# EAGLE design robotario-2 (EAGLE 9.5.1)
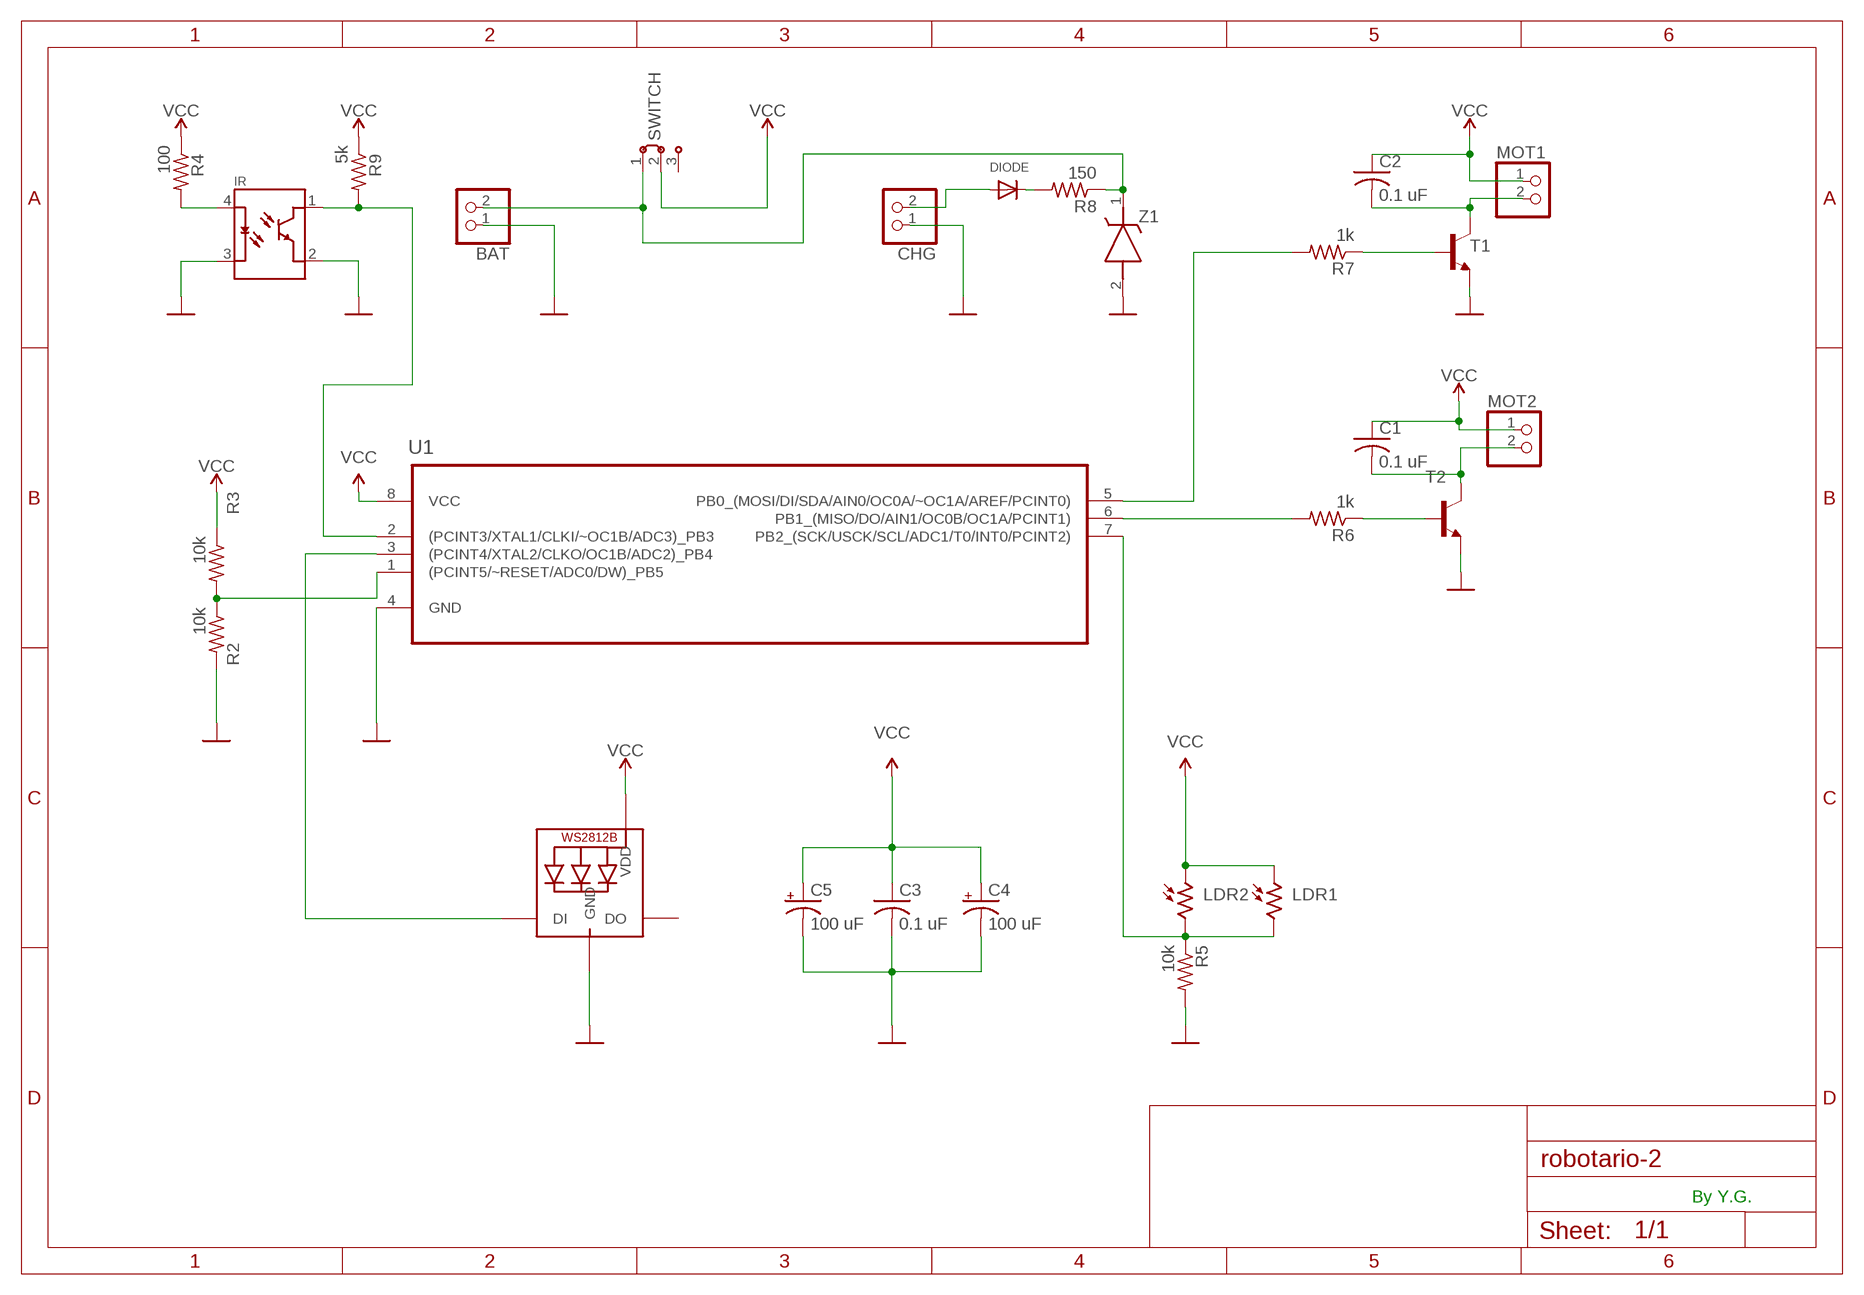
[diagram p0: schematic, sheet 1]
FRAME1 (A4L-LOC): AUTHOR: Y.

## Parts
BAT  PINHD-1X2  [1X02]
C1  0.1 uF  C-US050-024X044  [C050-024X044]
C2  0.1 uF  C-US050-024X044  [C050-024X044]
C3  0.1 uF  C-US050-024X044  [C050-024X044]
C4  100 uF  CPOL-USE5-5  [E5-5]
C5  100 uF  CPOL-USE5-5  [E5-5]
CHG  PINHD-1X2  [1X02]
DIODE  DIODEDO-1N4148  [DO-1N4148]
IR  TCRT5000L  [XDCR_TCRT5000L]
LDR1  A1050_14  [T0-46-A10XX]
LDR2  A1050_14  [T0-46-A10XX]
LED2  WS2812B5050  [WS2812B]
MOT1  PINHD-1X2  [1X02]
MOT2  PINHD-1X2  [1X02]
R2  10k  R-US_0207/10  [0207/10]
R3  10k  R-US_0207/10  [0207/10]
R4  100  R-US_0207/10  [0207/10]
R5  10k  R-US_0207/10  [0207/10]
R6  1k  R-US_0207/10  [0207/10]
R7  1k  R-US_0207/10  [0207/10]
R8  150  R-US_0207/10  [0207/10]
R9  5k  R-US_0207/10  [0207/10]
SWITCH  J2X2MM  [04C]
T1  2N3904  [TO92]
T2  2N3904  [TO92]
U1  ATTINY85-20PU  [DIP254P762X533-8]
Z1  NZX4V3C  BZX55C10  [DIOAD950W60L350D150]

## Nets
GND: BAT.1 C3.2 C4.- C5.- CHG.1 IR.2(E) IR.3(C) LED2.3-GND(GND) R2.2 R5.2 T1.3(E) T2.3(E) U1.4(GND) Z1.2(A)
N$1: BAT.2 R8.1 SWITCH.1 Z1.1(K)
N$2: R6.1 T2.2(B)
N$3: R7.1 T1.2(B)
N$4: R2.1 R3.2 U1.1((PCINT5/~RESET/ADC0/DW)_PB5)
N$5: IR.1(CO) R9.2 U1.2((PCINT3/XTAL1/CLKI/~OC1B/ADC3)_PB3)
N$6: LDR1.2 LDR2.2 R5.1 U1.7(PB2_(SCK/USCK/SCL/ADC1/T0/INT0/PCINT2))
N$7: C2.2 MOT1.2 T1.1(C)
N$8: CHG.2 DIODE.A
N$9: LED2.4-DIN(DI) U1.3((PCINT4/XTAL2/CLKO/OC1B/ADC2)_PB4)
N$10: C1.2 MOT2.2 T2.1(C)
N$11: R7.2 U1.5(PB0_(MOSI/DI/SDA/AIN0/OC0A/~OC1A/AREF/PCINT0))
N$12: R6.2 U1.6(PB1_(MISO/DO/AIN1/OC0B/OC1A/PCINT1))
N$14: DIODE.C R8.2
N$15: IR.4(A) R4.2
VCC: C1.1 C2.1 C3.1 C4.+ C5.+ LDR1.1 LDR2.1 LED2.1-VDD(VDD) MOT1.1 MOT2.1 R3.1 R4.1 R9.1 SWITCH.2 U1.8(VCC)
Unconnected: LED2.2-DOUT(DO) SWITCH.3

## Notes on the sheet
- By Y.G.

## Library data of the parts
BAT CHG MOT1 MOT2 = pinhead:PINHD-1X2: PIN HEADER
C1-C3 = adafruit:C-US: CAPACITOR, American symbol
C4 C5 = adafruit:CPOL-US: POLARIZED CAPACITOR, American symbol
DIODE = adafruit:DIODE: Diode SMADIODE - SMA Surface Mount Package 20V 1A Schottky Diode Digikey: 641-1014-6-ND DO-1N4148 - Through Hole Small Current Diode SOD-123 20V 1 A (.5mV Vf) Schottky Diode - Digikey: MBRX120TPMSCT-ND SOD-323 10V 570mA (.38mV Vf, 3ns) Schottky Diode - Digikey: ZLLS410CT-ND SOD-523 30V 30mA Schottky Diode (RB751S-40TE61) - Digikey: RB751S-40TE61CT-ND SOT23-R/W - SOT23 Package (R = Solder Paste/Reflow Ovens, W = Hand-Soldering) BAT54Film 40V 300mA - Digikey: 497-7162-1-ND
IR = TCRT5000L-edit:TCRT5000L: TCRT5000 Series 940 nm 100 mA 60 mA Transistor Output Reflective Optical Sensor; AVAILABILITY: Unavailable; DESCRIPTION: Photointerrupter Reflective Phototransistor 4-Pin Tube; MF: Vishay; MP: TCRT5000L; PACKAGE: PCB Mount Vishay Semiconductor; PRICE: None
LDR1 LDR2 = photo-elements:A10: Sensor Robust Light Sensing Applications Outdoor Light Sensing Application Source: http://optoelectronics.perkinelmer.com/content/Datasheets/DTS_PhotocellsA1050.pdf
LED2 = WS2812B:WS2812B; AVAILABILITY: Unavailable; DESCRIPTION: Intelligent Control Led Integrated Light Source Pack Of 10; MF: SparkFun Electronics; MP: WS2812B; PACKAGE: None; PRICE: None
R2-R9 = adafruit:R-US_: RESISTOR, American symbol
SWITCH = new-switch:J2: Jumper switch 2 x 2.5 mm
T1 T2 = new-t:2N3904: NPN TRANSISTOR
U1 = ATTINY85-20PU:ATTINY85-20PU: 8-bit Microcontroller with In-System Programmable Flash; AVAILABILITY: Unavailable; DESCRIPTION: ATtiny Series 20 MHz 8 KB Flash 512 B SRAM 8-Bit Microcontroller - DIP-8; MF: Microchip; MP: ATTINY85-20PU; PACKAGE: DIP-8 Microchip; PRICE: None
Z1 = BZX55C10:BZX55C10: Zener diode, 10V, 500mW, DO-35 Source: Datasheet <http://www.vishay.com/docs/85604/bzx55-se.pdf>; DESCRIPTION: BZX55 Series 10 V ±5 % 500 mW Through Hole Small Signal Zener Diode - DO-35; DIGI-KEY_PART_NUMBER: BZX55C10-GICT-ND; DIGI-KEY_PURCHASE_URL: https://www.digikey.hk/product-detail/en/vishay-semiconductor-diodes-division/BZX55C10-TR/BZX55C10-GICT-ND/6228440?utm_source=snapeda&utm_medium=aggregator&utm_campaign=symbol; MF: Vishay Semiconductor; MP: BZX55C10-TR; PACKAGE: DO-35 Vishay Semiconductor

## Board
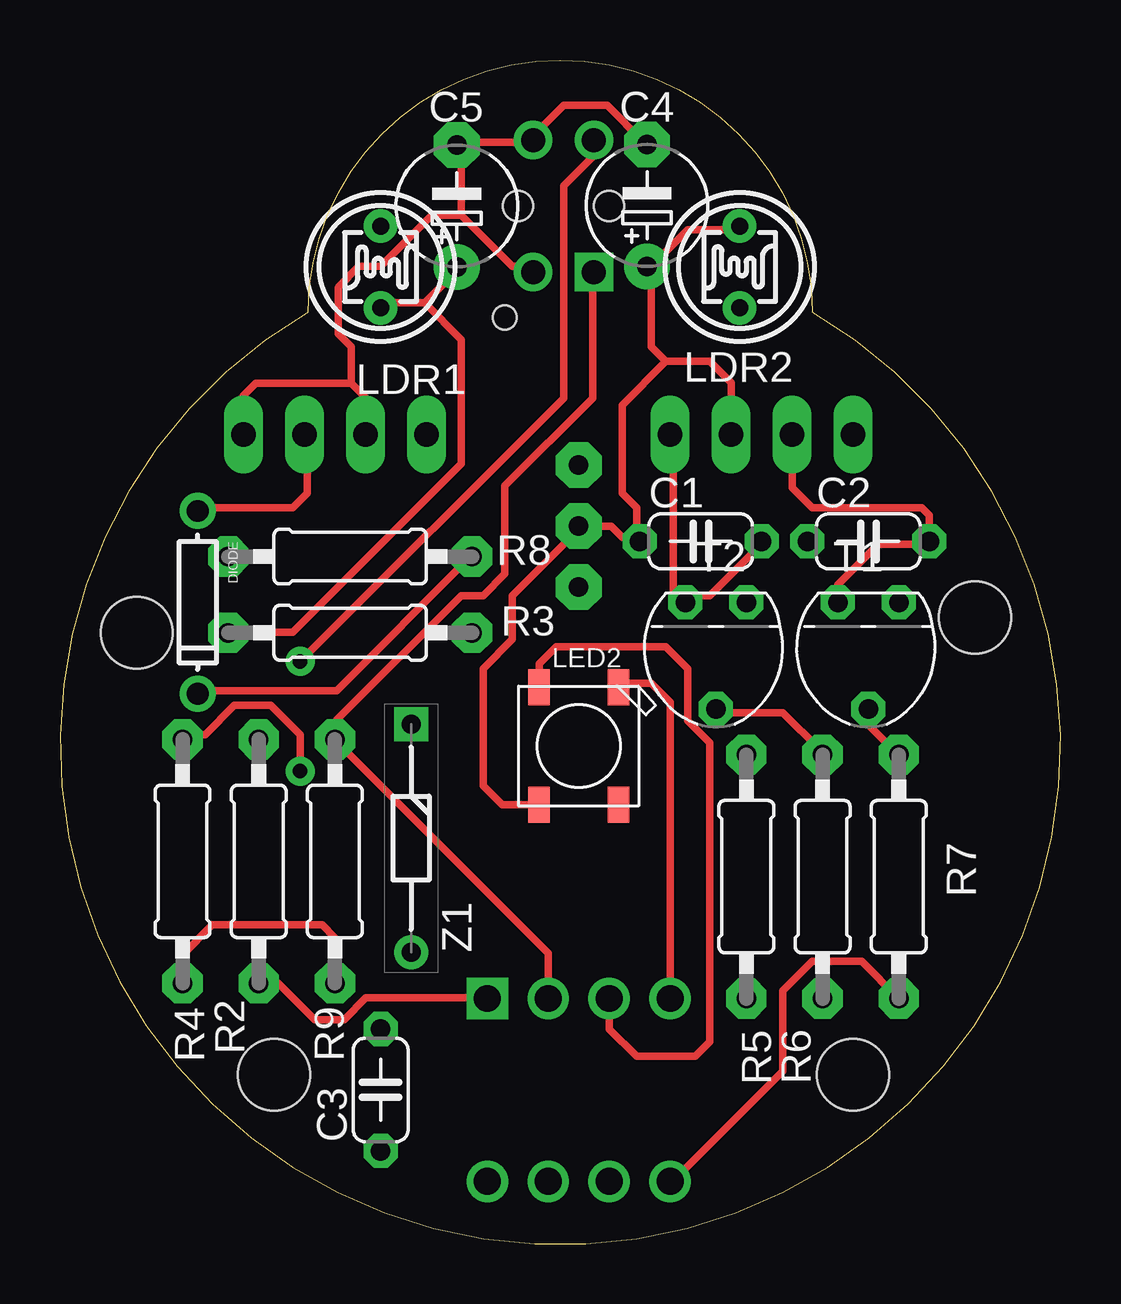
[diagram p1: board, top side]
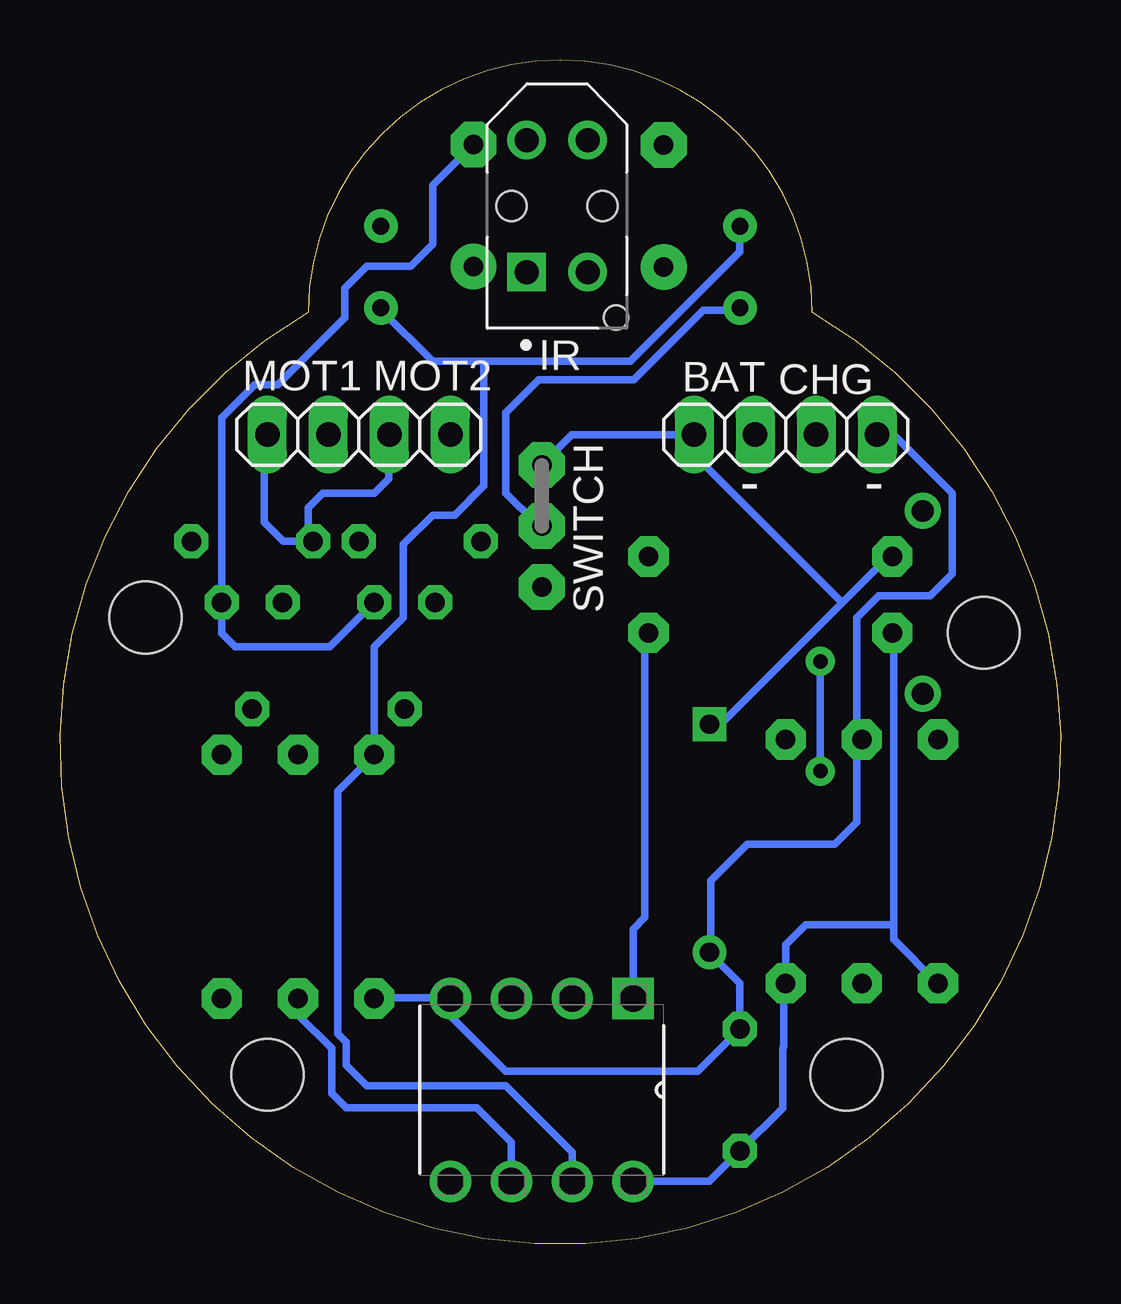
[diagram p2: board, bottom side, seen from below]

Size 41.69 x 49.33 mm. Coordinates in mm from the lower left corner, seen from the top.
Outline: 10.34,38.83 arc300 31.34,38.83 arc180 10.34,38.83
Copper layers (1*16): Top 0.035mm / dielectric 1.5mm / Bottom 0.035mm
Design rules "default *": minimum track width 12mil, minimum drill 0.6mm, track to track 12mil, track to pad 12mil, pad to pad 12mil, via to via 12mil, smd to smd 6mil, copper to edge 40mil, drill to drill 12mil, minimum pad ring 12mil, minimum via ring 12mil, stop-mask expansion 4mil, vias tented up to drill 0mil, thermal gap 10mil
Holes 3 mm at 3.2,25.47 38.12,26.1 8.91,7.05 33.04,7.05

### Footprints (pad centres in the part's own frame; a part is rotated, then mirrored left to right if it is on the bottom)
1X02 = drill 1.016 long: 1 -1.27,0; 2 1.27,0
C050-024X044 = drill 0.813 octagon: 1 -2.54,0; 2 2.54,0
E5-5 = drill 0.813 pad 1.905: + -2.54,0 | drill 0.813 pad 1.905 octagon: - 2.54,0
DO-1N4148 = drill 0.9: A -3.81,0; C 3.81,0
XDCR_TCRT5000L = drill 1 pad 1.6 square: 1 -2.75,1.27 | drill 1 pad 1.6: 2 -2.75,-1.27; 3 2.75,-1.27; 4 2.75,1.27 | hole 1.25: 0,1.9; 0,-1.9 | hole 1: -4.65,-2.45
T0-46-A10XX = drill 0.7 pad 1.4: 1 -1.7,0; 2 1.7,0
WS2812B = smd 1.5 x 0.9: 1-VDD 2.45,-1.65; 2-DOUT 2.45,1.65; 3-GND -2.45,1.65; 4-DIN -2.45,-1.65
0207/10 = drill 0.813 pad 1.676 octagon: 1 -5.08,0; 2 5.08,0
04C = drill 0.813 pad 1.905 octagon: 1 -0.635,0; 2 1.905,0; 3 4.445,0
TO92 = drill 0.813 octagon: 1 1.27,-2.54; 2 0,1.905; 3 -1.27,-2.54
DIP254P762X533-8 = drill 1.118 square: 1 -7.62,7.62 | drill 1.118: 2 -7.62,5.08; 3 -7.62,2.54; 4 -7.62,0; 5 0,0; 6 0,2.54; 7 0,5.08; 8 0,7.62
DIOAD950W60L350D150 = drill 0.8 pad 1.2 square: 1 0,0 | drill 0.8 pad 1.2: 2 9.5,0

### Placement (x,y rotation side)
BAT  13.99,33.72 180 bottom
C1  26.69,29.28 0 top
C2  33.68,29.28 0 top
C3  13.36,6.42 90 top
C4  24.46,43.27 90 top
C5  16.53,43.25 90 top
CHG  8.91,33.72 180 bottom
DIODE  5.74,26.74 270 top
IR  20.98,43.25 90 bottom
LDR1  13.36,40.71 90 top
LDR2  28.32,40.71 270 top
LED2  21.61,20.74 270 top
MOT1  31.77,33.72 0 bottom
MOT2  26.69,33.72 0 bottom
R2  8.28,15.94 90 top
R3  12.09,25.47 0 top
R4  5.1,15.94 90 top
R5  28.6,15.31 270 top
R6  31.77,15.31 270 top
R7  34.95,15.31 270 top
R8  12.09,28.64 0 top
R9  11.45,15.94 90 top
SWITCH  21.61,31.82 270 bottom
T1  33.68,24.2 180 top
T2  27.33,24.2 180 top
U1  25.42,2.61 270 bottom
Z1  14.63,21.66 270 top

### Tracks (layer width: path | path; a pad name or v marks a point on that pad's centre or on a via)
GND
  Top 0.305: 12.44,33.72 BAT.1 12.72,35.27 12.14,35.85 | 16.71,42.86 18.85,40.73 19.46,40.73 IR.2 | 16.71,42.86 16.71,45.61 C5.- 16.71,45.91 19.46,45.91 IR.3 19.76,46.22 20.98,47.44 22.81,47.44 24.33,45.91 C4.- | 16.71,42.86 15.49,42.86 13.36,40.73 12.44,40.73 11.61,39.89 11.6,39.81 11.6,37.92 12.14,37.38 12.14,35.85 | 28.6,26.71 T2.3 | 12.14,35.85 8.15,35.85 8.14,35.85 7.71,35.41 7.64,35.35 CHG.1 | LED2.3-GND 23.43,23.36 24.64,23.36 25.42,22.57 U1.4
  Bottom 0.305: R5.2 28.6,10.25 25.55,10.25 U1.4 25.42,9.51 23.11,7.2 15.11,7.2 C3.2 | 14.58,12.08 Z1.2 | 13.36,9.03 C3.2 | CHG.1 6.96,33.72 4.52,31.28 4.52,27.93 5.43,27.02 7.57,27.02 8.48,26.1 8.48,21.22 | C3.2 13.36,10.86 14.58,12.08 | 14.58,12.08 14.58,15.13 13.05,16.65 9.4,16.65 8.48,17.57 8.48,21.22 | 8.48,21.22 R2.2 | T2.3 30.45,24.88 34.39,24.88 34.95,25.44 T1.3 34.95,34.42 33.57,35.8 32.61,35.8 30.37,38.05 30.34,38.06 30.33,38.08 29.82,38.6 29.82,39.82 28.9,40.73 27.08,40.73 26.16,41.65 26.16,44.11 C4.-
N$1
  Bottom 0.305: SWITCH.1 21.59,32.5 20.37,33.72 BAT.2 15.19,33.72 15.19,32.81 9.09,26.71 | 9.09,26.71 7.26,28.54 R8.1 | 9.09,26.71 13.97,21.83 14.58,21.83 Z1.1
N$2
  Top 0.305: T2.2 27.38,22.14 30.12,22.14 31.65,20.61 R6.1
N$3
  Top 0.305: T1.2 33.78,22.14 33.78,21.53 34.7,20.61 R7.1
N$4
  Top 0.305: R2.1 9.09,10.86 10.62,9.34 11.84,9.34 12.75,10.25 17.63,10.25 U1.1
  Bottom 0.305: R3.2 17.32,25.19 17.32,13.6 17.8,13.12 U1.1
N$5
  Top 0.305: IR.1 22.2,40.43 22.2,35.24 18.54,31.59 18.54,27.93 17.63,27.02 16.71,27.02 11.53,21.83 11.53,21.22 R9.2 11.53,20.92 20.34,12.11 U1.2
N$6
  Bottom 0.305: LDR1.2 13.36,41.34 17.93,36.77 24.03,36.77 | 24.03,36.77 26.16,36.77 28.29,38.9 LDR2.2 | 24.03,36.77 24.03,31.59 25.25,30.37 26.16,30.37 27.38,29.15 27.38,26.1 28.6,24.88 R5.1 30.12,18.86 30.12,8.77 29.77,8.41 29.77,7.46 28.9,6.59 23.11,6.59 20.34,3.83 U1.7
N$7
  Top 0.305: 30.73,33.72 MOT1.2 30.5,31.51 31.34,30.67 32.87,30.67 33.78,30.67 35.91,30.67 36.22,30.37 C2.2 36.22,29.15 34.09,29.15 32.41,27.47 T1.1
N$8
  Top 0.305: DIODE.A 5.74,30.67 9.7,30.67 10.31,31.28 10.31,33.72 CHG.2
N$9
  Top 0.305: LED2.4-DIN 19.96,24.17 20.67,24.88 25.25,24.88 26.16,23.97 26.16,21.81 27.08,20.89 27.08,8.42 26.47,7.81 24.03,7.81 22.88,8.96 U1.3
N$10
  Top 0.305: 25.55,33.11 25.55,33.72 MOT2.2 25.55,33.59 25.55,27.24 T2.1 26.16,27.02 27.08,27.02 29.21,29.15 C1.2 29.23,29.43
N$11
  Top 0.305: U1.5 25.55,2.63 30.12,7.2 30.12,10.56 31.34,11.78 33.4,11.78 R7.2
N$12
  Bottom 0.305: U1.6 22.88,4.23 24.33,5.68 29.77,5.68 30.38,6.29 30.38,8.16 31.77,9.55 R6.2
N$14
  Top 0.305: DIODE.C 5.74,23.05 11.53,23.05 17.02,28.54 R8.2
N$15  (via drill 0.6)
  Top 0.305: v10.01,24.27 20.98,35.24 20.98,44.08 22.2,45.3 22.2,45.91 IR.4 | v10.01,19.7 10.01,21.22 8.79,22.44 7.26,22.44 6.04,21.22 5.13,21.22 R4.2
  Bottom 0.305: v10.01,19.7 v10.01,24.27
VCC
  Top 0.305: 24.64,40.73 26.16,42.26 28.29,42.26 LDR2.1 | 24.64,40.73 24.64,37.38 25.25,36.77 | 24.64,40.73 C4.+ | 15.19,39.21 13.36,39.21 LDR1.1 | 15.19,39.21 16.41,40.43 C5.+ | 24.03,29.45 23.42,29.45 22.96,29.91 SWITCH.2 21.59,29.76 18.85,27.02 18.85,25.19 17.63,23.97 17.63,19.09 18.43,18.29 LED2.1-VDD | 24.03,29.45 24.03,30.67 23.42,31.28 23.42,34.94 25.25,36.77 | 24.03,29.45 C1.1 | 15.19,39.21 16.71,37.68 16.71,32.5 9.7,25.49 7.26,25.49 R3.1 | R9.1 11.45,12.77 10.92,13.3 6.35,13.3 5.1,12.05 R4.1 | MOT2.1 27.96,35.88 27.08,36.77 25.25,36.77
  Bottom 0.305: 6.96,13.3 6.96,12.69 5.13,10.86 R4.1 | 6.96,13.3 6.96,25.19 R3.1 | 31.34,29.45 C2.1 31.34,29.28 | 33.17,33.72 MOT1.1 33.17,33.59 33.17,30.06 32.38,29.28 31.34,29.28 | MOT2.1 27.99,33.72 27.99,31.89 28.6,31.28 30.73,31.28 31.34,30.67 31.34,29.28 | LDR1.1 13.36,38.9 14.88,38.9 17.78,36.01 21.74,36.01 23.11,34.64 23.11,31.28 21.89,30.06 SWITCH.2 | U1.8 14.63,2.61 C3.1 11.58,5.65 11.58,8.16 11.53,8.21 11.53,10.86 R9.1 11.45,12.46 10.62,13.3 6.96,13.3

### Text on the board
bNames: - | -
bValues: Robotario v2 | 2019/11/16 | Design by Y.G.